# Altium schematic sheet DIO_blk.SchDoc
size A4; Engineer: JBayalas; DocumentNumber: 11; Revision: V1.0; SheetNumber: 11; SheetTotal: 11
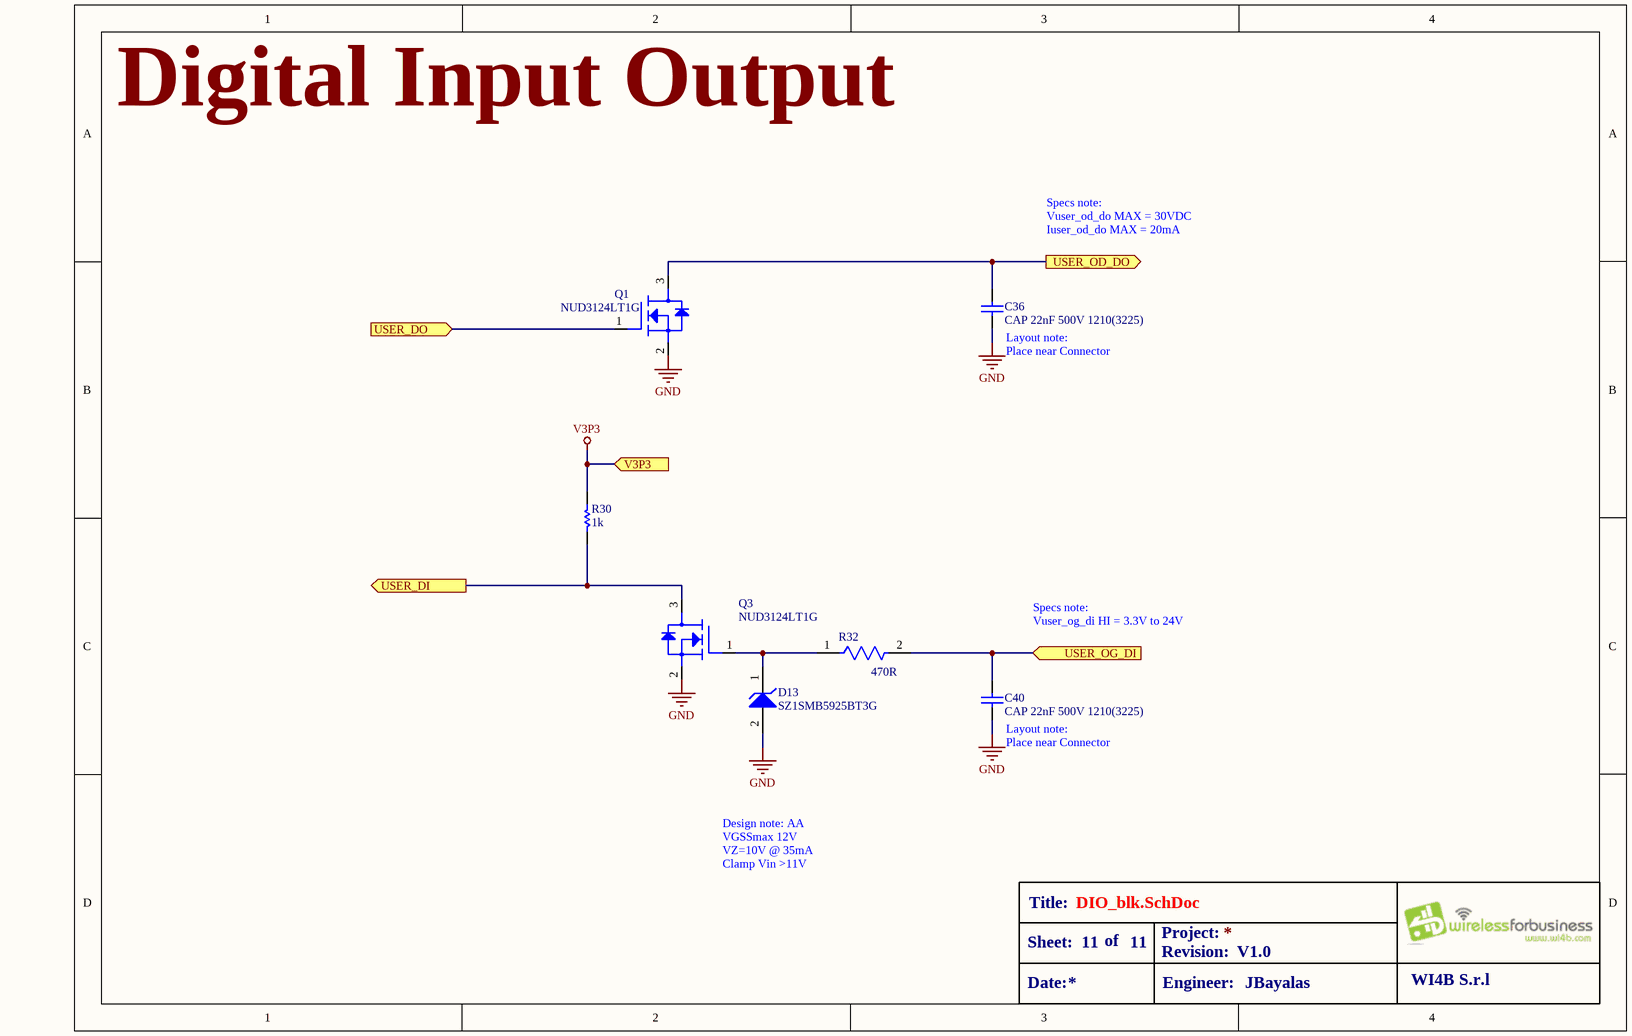
[diagram p0: DIO_blk.SchDoc]

## Parts
C36  CAP 22nF 500V 1210(3225)  [CAPC1210(3225)190_N]
C40  CAP 22nF 500V 1210(3225)  [CAPC1210(3225)190_N]
D13  SZ1SMB5925BT3G  [ONSC-SMB-2-403A-03_H_V]
Q1  NUD3124LT1G  [SOT-23-3]
Q3  NUD3124LT1G  [SOT-23-3]
R30  value 1k  [R0402]  (hidden comment: MCS04020C1001FE000)
R32  Resistance: 470R  [FP-CRCW2010-e3-MFG]  (hidden comment: CRCW2010470RJNEF)

## Ports
USER_DI (out), USER_DO (in), USER_OD_DO (out), USER_OG_DI (in), V3P3 (in)

## Nets
GND: C36.1 C40.1 D13.2(A) Q1.2(source) Q3.2(source)
V3P3: R30.2 ; port V3P3
USER_DI: Q3.3(drain) R30.1 ; port USER_DI
USER_DO: Q1.1(gate) ; port USER_DO
USER_OD_DO: C36.2 Q1.3(drain) ; port USER_OD_DO
USER_OG_DI: C40.2 R32.2 ; port USER_OG_DI
NetD13_1: D13.1(K) Q3.1(gate) R32.1

## Notes on the sheet
- Digital Input Output
- Specs note:
  Vuser_od_do MAX = 30VDC
  Iuser_od_do MAX = 20mA
- (near C36) Layout note:
  Place near Connector
- Specs note:
  Vuser_og_di HI = 3.3V to 24V
- (near C40) Layout note:
  Place near Connector
- Design note: AA
  VGSSmax 12V
  VZ=10V @ 35mA
  Clamp Vin >11V
- Title:
- Sheet:
- Date:
- of
- Project:
- Revision:
- Engineer:
- WI4B S.r.l

## Library data of the parts
C36 C40 = CMP-1038-01323-1: CAP 22nF 500V ±10% 1210 (3225 Metric) Thickness 1.9mm SMD; Case-EIA: 1210; Tolerance: Â±10%; Case-Metric: 3225; Rated Voltage: 500 V; Technology: SMT; Value: 22nF; Max Thickness: 1.9 mm
D13 = CMP-1060-00216-1: 3 W Zener Voltage Regulator, 2-Pin SMB, Pb-Free, Tape and Reel; Manufacturer: On Semiconductor; VZ Typ (V): 10; PackageReference: SMB-2-403A-03_H; ComponentLink3Description: Package Specification; RoHS: Pb-Free; ComponentLink2Description: Datasheet; ComponentLink3URL: http://www.onsemi.com/pub_link/Collateral/1SMB5913BT3-D.PDF; PackageVersion: Rev. H, 05/2011; PackageDescription: 2-Pin Small Molded Package, J-Bend Lead, Body 4.33 x 3.625 mm; Packing: Tape and Reel; DatasheetVersion: Rev. 8; PartNumber: SZ1SMB5925BT3G; ComponentLink2URL: http://www.onsemi.com/pub_link/Collateral/1SMB5913BT3-D.PDF; ComponentLink1Description: Manufacturer URL; Mounting Technology: Surface Mount; ComponentLink1URL: http://www.onsemi.com/
Q1 Q3 = NUD3124LT1G: IC INDCT LOAD DRVR AUTO SOT23; MFT: ON Semiconductor; TYPE: Surface Mount; FUNCTION: PWM OUT; VALUE: NUD3124LT1G; MPN: NUD3124LT1G
R30 = MCS04020C1001FE000: RES SMD 1K OHM 1% 1/10W 0402; MFT: Vishay Beyschlag; MPN: MCS04020C1001FE000; TYPE: SMD; RATING: 1/10W; DNP: *
R32 = CMP-02407-006305-1: RES Thick Film, 470Ω, 5%, 0.75W, 200ppm/°C, 2010; Max Power Dissipation: 750mW; Voltage Rating: 400V; Package Quantity: 4000; Max Operating Temperature: 155°C; Min Operating Temperature: -55°C; Military Standard: Not; Length: 5mm; Radiation Hardening: No; Features: Automotive AEC-Q200; Contact Plating: Tin; Case Code (Imperial): 2010; Width: 0.098inch; Composition: Thick Film; Lead Free: Lead Free; Depth: 2.5mm; Case/Package: 2010; Packaging: Tape and Reel; Case Code (Metric): 5025; Mount: Surface Mount; Tolerance: 5%; Temperature Coefficient: 200ppm/°C; Power Rating: 750mW; Voltage Rating (DC): 400V; Weight: 0.001372oz; Height: 0.6mm; Termination: SMD/SMT; Number of Terminations: 2